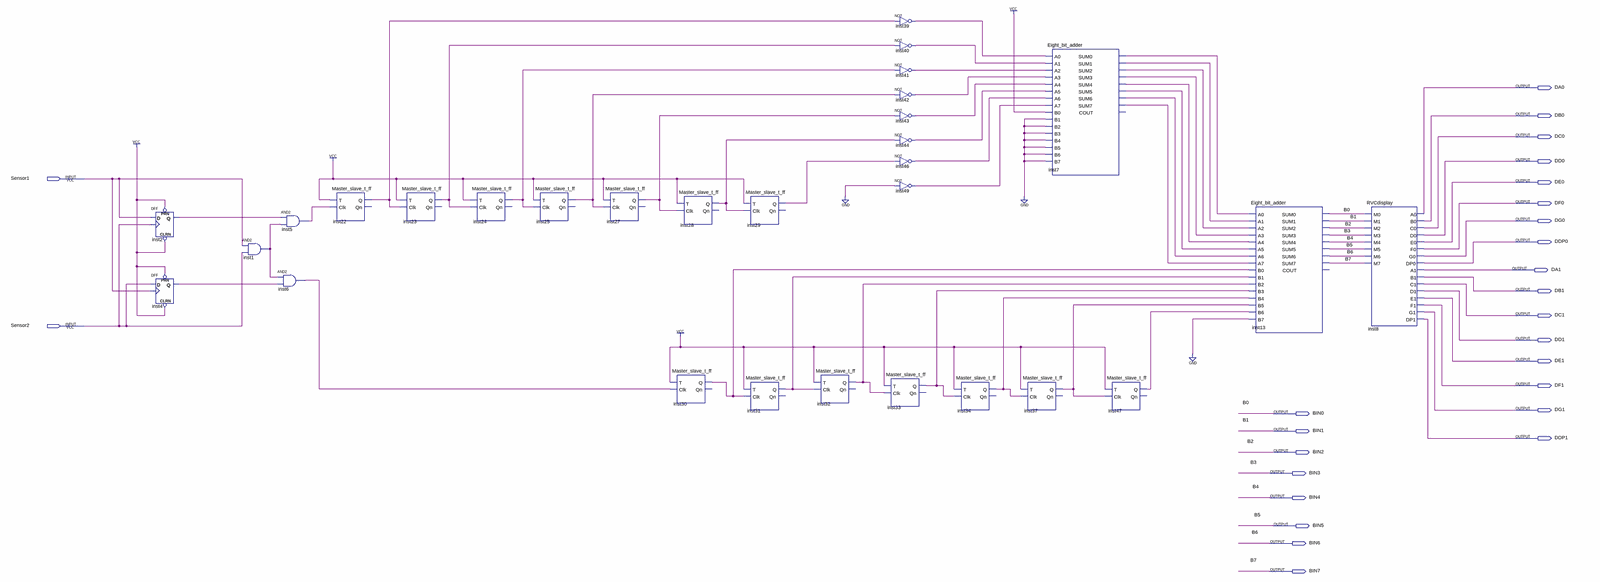
[diagram p0: schematic sheet, whole]
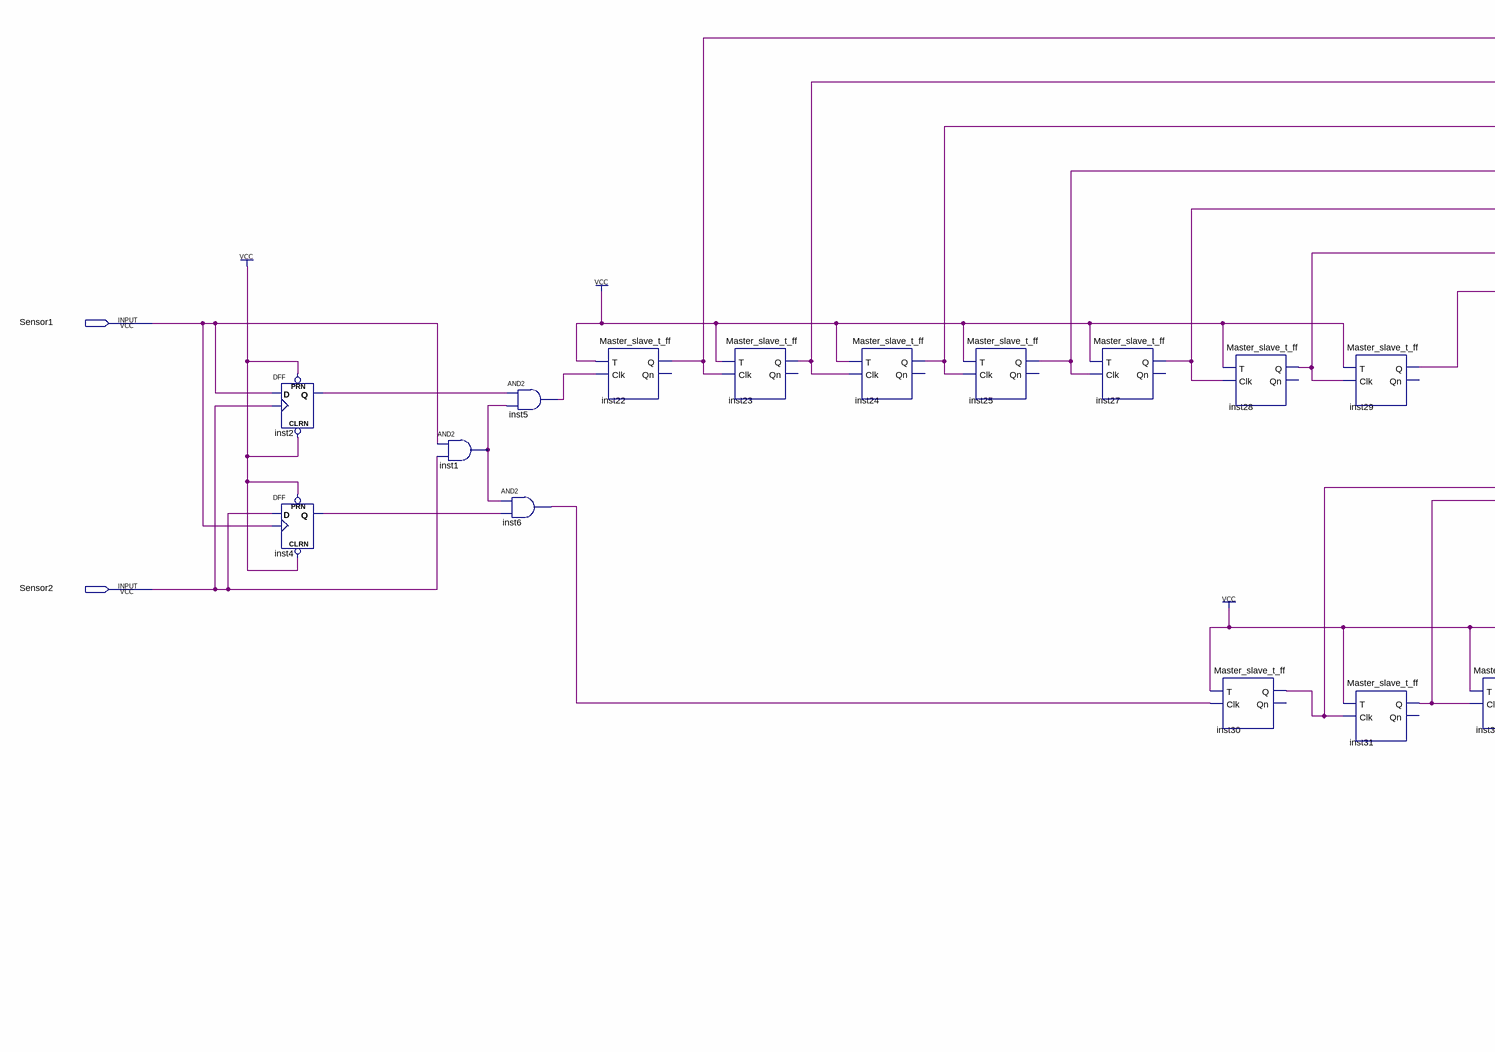
[diagram p1: schematic sheet, left part]
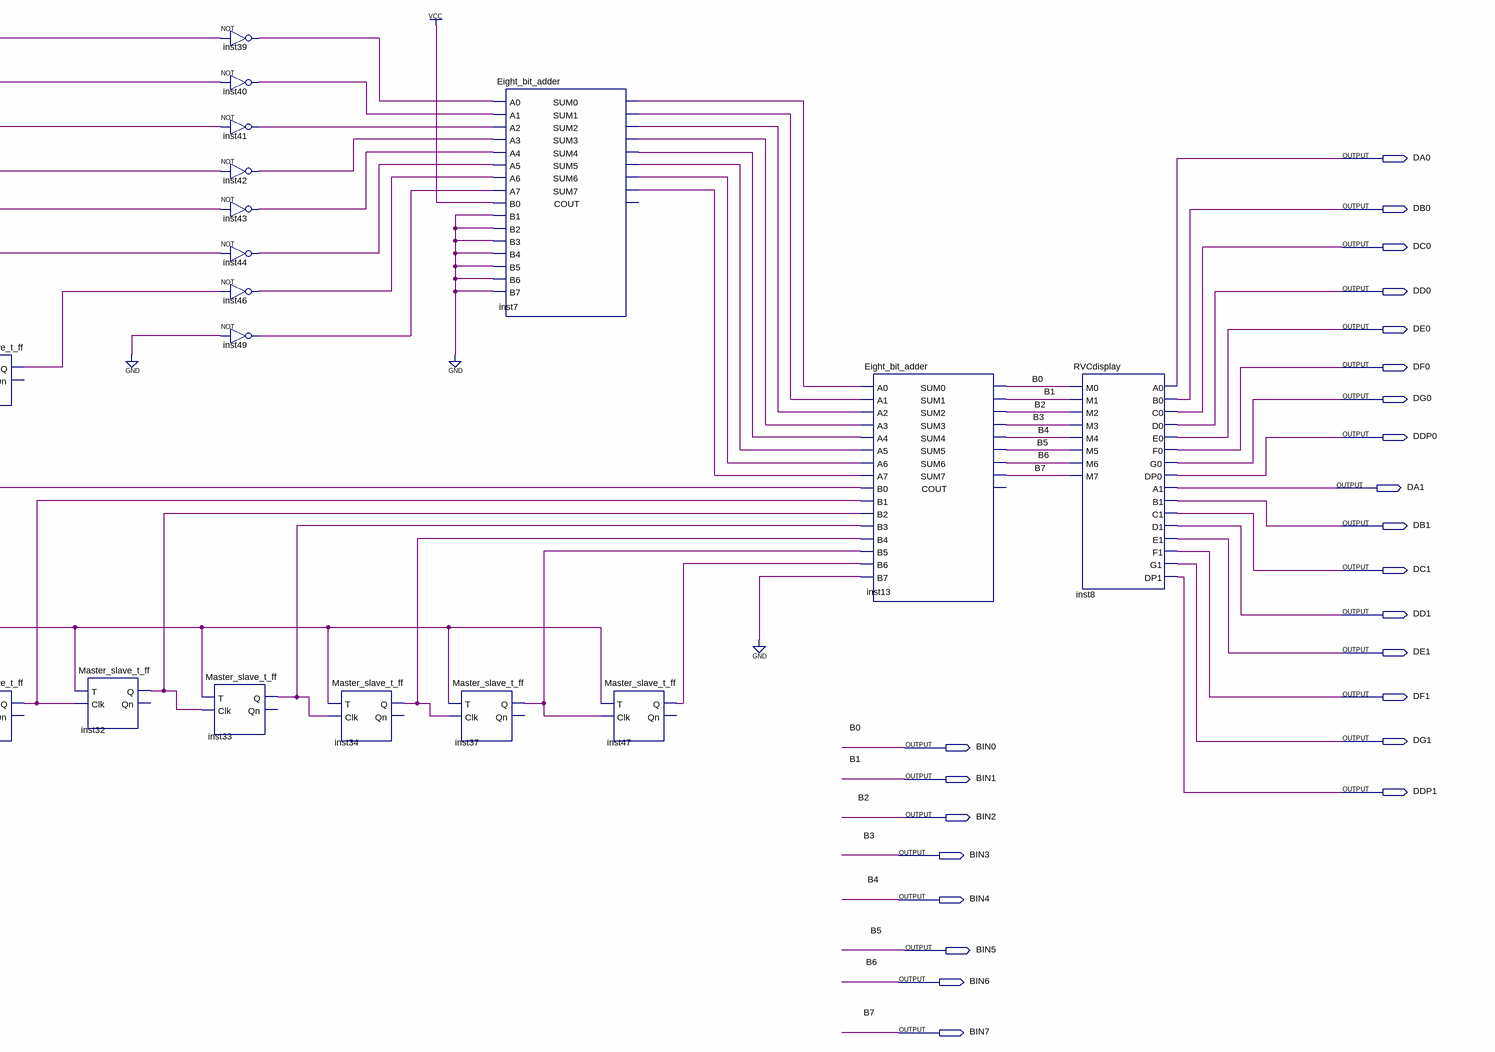
[diagram p2: schematic sheet, right part]
// Quartus schematic RVCcounter.bdf as structural Verilog: 30 symbols, 26 pins
module RVCcounter (
  input  Sensor1,
  input  Sensor2,
  output DA0,
  output DB0,
  output DC0,
  output DD0,
  output DE0,
  output DF0,
  output DG0,
  output DDP0,
  output DA1,
  output DB1,
  output DC1,
  output DD1,
  output DE1,
  output DF1,
  output DG1,
  output BIN0,
  output BIN1,
  output DDP1,
  output BIN2,
  output BIN3,
  output BIN4,
  output BIN5,
  output BIN6,
  output BIN7
);

  wire inst1_out, inst2_q, inst4_q, inst5_out, inst6_out, inst7_sum0, inst7_sum1, inst7_sum2, inst7_sum3,
       inst7_sum4, inst7_sum5, inst7_sum6, inst7_sum7, inst22_q, inst23_q, inst24_q, inst25_q, inst27_q,
       inst28_q, inst29_q, inst30_q, inst31_q, inst32_q, inst33_q, inst34_q, inst37_q, inst39_out,
       inst40_out, inst41_out, inst42_out, inst43_out, inst44_out, inst46_out, inst47_q, inst49_out;

  DFF inst2 (.CLRN(1'b1), .CLK(Sensor2), .D(Sensor1), .PRN(1'b1), .Q(inst2_q));
  DFF inst4 (.CLRN(1'b1), .CLK(Sensor1), .D(Sensor2), .PRN(1'b1), .Q(inst4_q));
  and inst1 (inst1_out, Sensor1, Sensor2);
  and inst5 (inst5_out, inst2_q, inst1_out);
  and inst6 (inst6_out, inst1_out, inst4_q);
  Master_slave_t_ff inst22 (.T(1'b1), .Clk(inst5_out), .Q(inst22_q));  // open: Qn
  Master_slave_t_ff inst23 (.T(1'b1), .Clk(inst22_q), .Q(inst23_q));  // open: Qn
  Master_slave_t_ff inst24 (.T(1'b1), .Clk(inst23_q), .Q(inst24_q));  // open: Qn
  Master_slave_t_ff inst25 (.T(1'b1), .Clk(inst24_q), .Q(inst25_q));  // open: Qn
  Master_slave_t_ff inst27 (.T(1'b1), .Clk(inst25_q), .Q(inst27_q));  // open: Qn
  Master_slave_t_ff inst28 (.T(1'b1), .Clk(inst27_q), .Q(inst28_q));  // open: Qn
  Master_slave_t_ff inst30 (.T(1'b1), .Clk(inst6_out), .Q(inst30_q));  // open: Qn
  Master_slave_t_ff inst29 (.T(1'b1), .Clk(inst28_q), .Q(inst29_q));  // open: Qn
  Master_slave_t_ff inst31 (.T(1'b1), .Clk(inst30_q), .Q(inst31_q));  // open: Qn
  Master_slave_t_ff inst32 (.T(1'b1), .Clk(inst31_q), .Q(inst32_q));  // open: Qn
  Master_slave_t_ff inst33 (.T(1'b1), .Clk(inst32_q), .Q(inst33_q));  // open: Qn
  not inst39 (inst39_out, inst22_q);
  not inst40 (inst40_out, inst23_q);
  not inst41 (inst41_out, inst24_q);
  not inst42 (inst42_out, inst25_q);
  not inst43 (inst43_out, inst27_q);
  not inst44 (inst44_out, inst28_q);
  not inst46 (inst46_out, inst29_q);
  not inst49 (inst49_out, 1'b0);
  Master_slave_t_ff inst34 (.T(1'b1), .Clk(inst33_q), .Q(inst34_q));  // open: Qn
  Master_slave_t_ff inst37 (.T(1'b1), .Clk(inst34_q), .Q(inst37_q));  // open: Qn
  Eight_bit_adder inst7 (
    .A0(inst39_out), .A1(inst40_out), .A2(inst41_out), .A3(inst42_out), .A4(inst43_out), .A5(inst44_out),
    .A6(inst46_out), .A7(inst49_out), .B0(1'b1), .B1(1'b0), .B2(1'b0), .B3(1'b0), .B4(1'b0), .B5(1'b0),
    .B6(1'b0), .B7(1'b0), .SUM0(inst7_sum0), .SUM1(inst7_sum1), .SUM2(inst7_sum2), .SUM3(inst7_sum3),
    .SUM4(inst7_sum4), .SUM5(inst7_sum5), .SUM6(inst7_sum6), .SUM7(inst7_sum7));  // open: COUT
  Master_slave_t_ff inst47 (.T(1'b1), .Clk(inst37_q), .Q(inst47_q));  // open: Qn
  Eight_bit_adder inst13 (
    .A0(inst7_sum0), .A1(inst7_sum1), .A2(inst7_sum2), .A3(inst7_sum3), .A4(inst7_sum4), .A5(inst7_sum5),
    .A6(inst7_sum6), .A7(inst7_sum7), .B0(inst30_q), .B1(inst31_q), .B2(inst32_q), .B3(inst33_q),
    .B4(inst34_q), .B5(inst37_q), .B6(inst47_q), .B7(1'b0), .SUM0(BIN0), .SUM1(BIN1), .SUM2(BIN2),
    .SUM3(BIN3), .SUM4(BIN4), .SUM5(BIN5), .SUM6(BIN6), .SUM7(BIN7));  // open: COUT
  RVCdisplay inst8 (
    .M0(BIN0), .M1(BIN1), .M2(BIN2), .M3(BIN3), .M4(BIN4), .M5(BIN5), .M6(BIN6), .M7(BIN7), .A0(DA0),
    .B0(DB0), .C0(DC0), .D0(DD0), .E0(DE0), .F0(DF0), .G0(DG0), .DP0(DDP0), .A1(DA1), .B1(DB1), .C1(DC1),
    .D1(DD1), .E1(DE1), .F1(DF1), .G1(DG1), .DP1(DDP1));

  // Other names for the same wires on the sheet: B0 = BIN0; B1 = BIN1; B2 = BIN2; B3 = BIN3; B4 = BIN4; B5 = BIN5;
  //   B6 = BIN6; B7 = BIN7
endmodule
